# Altium schematic sheet MCU009B_CoverSheet.SchDoc: Cover Sheet
size 431 x 279 mm; Date: Not shown in title block; ApprovedBy: Not shown in title block; CheckedBy: Not shown in title block; Author: Not shown in title block; CompanyName: Not shown in title block; DrawnBy: Brett Larimore; Engineer: Not shown in title block; Organization: Not shown in title block; Address1: Not shown in title block; Address2: Not shown in title block; Address3: Not shown in title block; Address4: Not shown in title block; DocumentNumber: 1; Revision: Use project parameter SCH_Rev; SheetNumber: 1; SheetTotal: 7; PageSetup: Record=PageOptions|CenterHorizontal=True|CenterVertical=True|PrintScale=1.00|XCorrection=1.00|YCorrection=1.00|PrintKind=0|BorderSize=5000000|LeftOffset=0|BottomOffset=0|Orientation=2|PaperLength=1000|PaperWidth=1000|Scale=100|PaperSource=15|PrintQuality=600|MediaType=1|DitherType=10|PaperKind=Letter|PrintScaleMode=1; CurrentTime: Not shown in title block; CurrentDate: Not shown in title block; Time: Not shown in title block; DocumentFullPathAndName: Not shown in title block; DocumentName: Not shown in title block; ModifiedDate: Not shown in title block; ImagePath: Not shown in title block
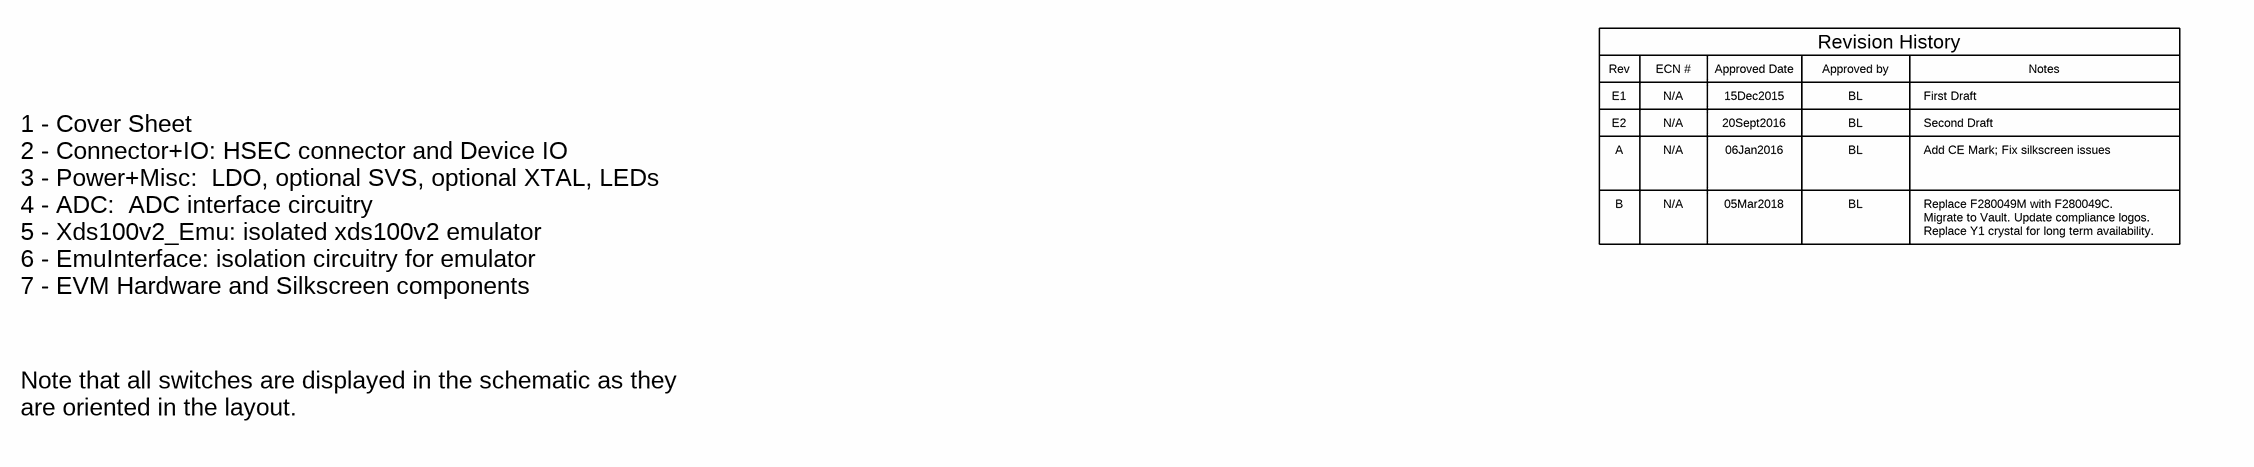
[diagram p0: MCU009B_CoverSheet.SchDoc]

## Notes on the sheet
- Rev
- E1
- ECN #
- N/A
- Approved Date
- 15Dec2015
- Approved by
- BL
- Revision History
- First Draft
- Notes
- E2
- A
- 20Sept2016
- 06Jan2016
- Second Draft
- Add CE Mark; Fix silkscreen issues
- B
- 05Mar2018
- Replace F280049M with F280049C.
- Migrate to Vault. Update compliance logos.
- Replace Y1 crystal for long term availability.
- 1 - Cover Sheet
  2 - Connector+IO: HSEC connector and Device IO
  3 - Power+Misc:  LDO, optional SVS, optional XTAL, LEDs
  4 - ADC:  ADC interface circuitry
  5 - Xds100v2_Emu: isolated xds100v2 emulator
  6 - EmuInterface: isolation circuitry for emulator
  7 - EVM Hardware and Silkscreen components
- Note that all switches are displayed in the schematic as they are oriented in the layout.
- Drawn By:
- SVN Rev:
- Number:
- TID #:
- Orderable:
- Rev:
- Sheet Title:
- File:
- Project Title:
- Designed for:
- Assembly Variant:
- Mod. Date:
- Sheet:
- Size:
- of
- http://www.ti.com
- Texas Instruments and/or its licensors do not warrant the accuracy or completeness of this specification or any information contained therein. Texas Instruments and/or its licensors do not warrant that this design will meet the specifications, will be suitable for your application or fit for any particular purpose, or will operate in an implementation. Texas Instruments and/or its licensors do not warrant that the design is production worthy. You should completely validate and test your design implementation to confirm the system functionality for your application.
- Engineer:
- Contact:
- © Texas Instruments